# Altium schematic sheet Slave_Schematic2.SchDoc
size A4; SheetNumber: 2; SheetTotal: 2
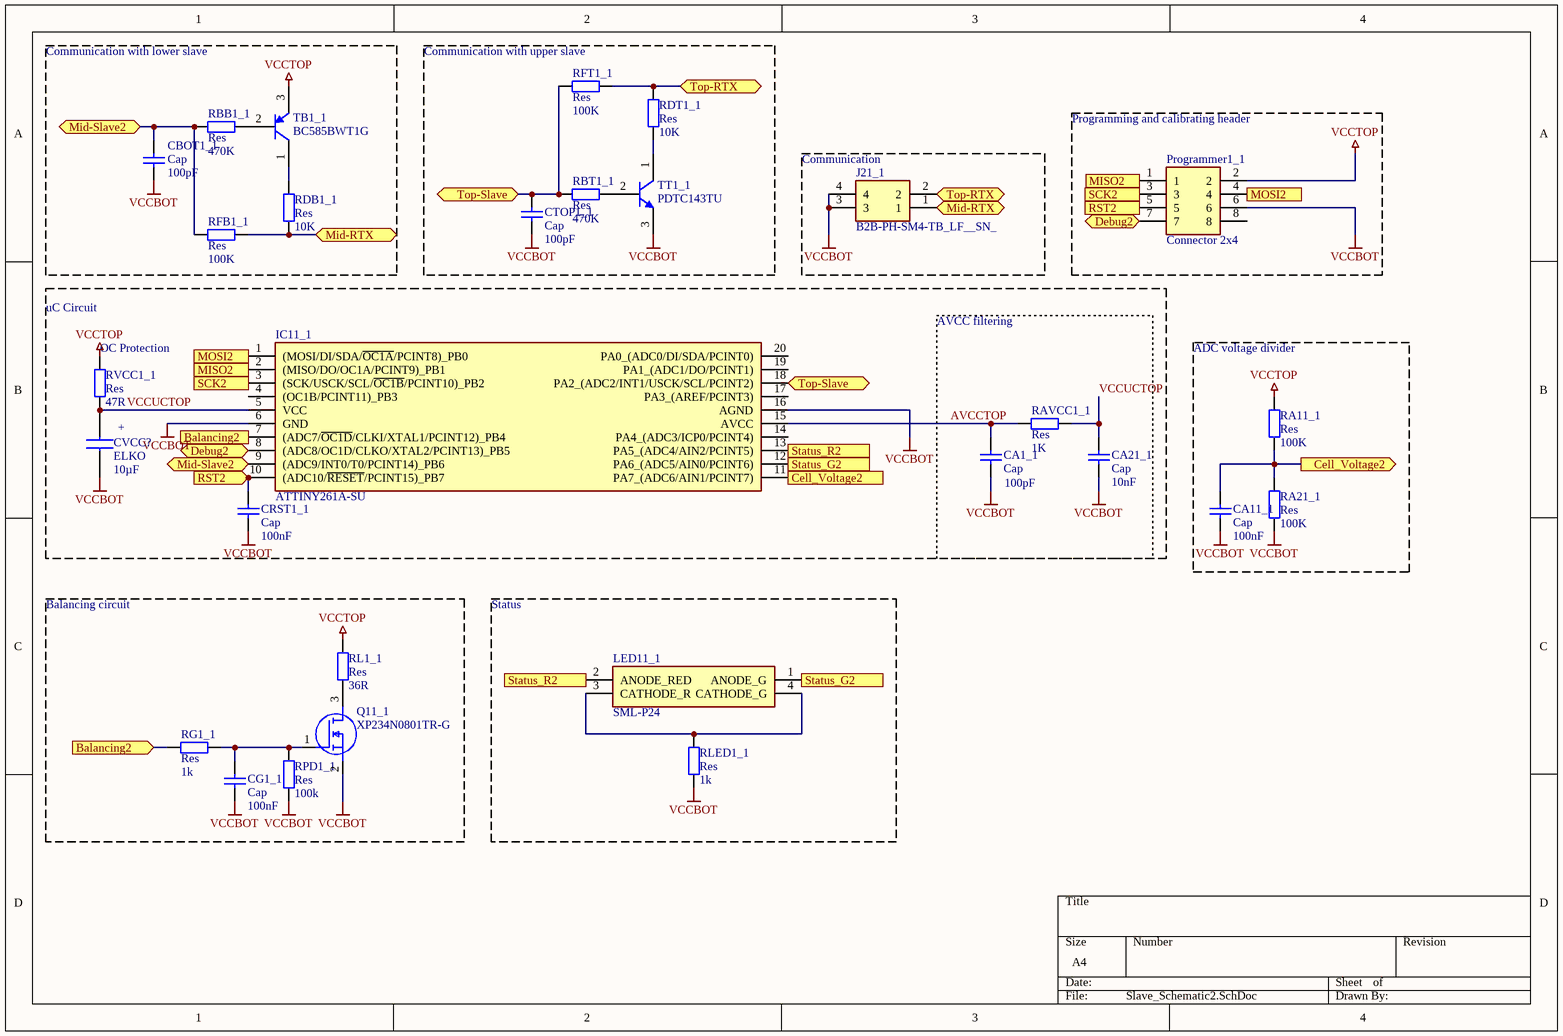
[diagram p0: Slave_Schematic2.SchDoc]

## Parts
CA1_1  Cap  value 100pF  [0603]
CA11_1  Cap  value 100nF  [0603]
CA21_1  Cap  value 10nF  [0603]
CBOT1_1  Cap  value 100pF  [0603]
CG1_1  Cap  value 100nF  [0603]
CRST1_1  Cap  value 100nF  [0603]
CTOP1_1  Cap  value 100pF  [0603]
CVCC?  ELKO  value 10µF  [CAP 5x5,5]
IC11_1  ATTINY261A-SU  [TSSOP-20T (MO-153 AC)]
J21_1  B2B-PH-SM4-TB_LF__SN_  [JST-PHR]
LED11_1  SML-P24  [1010 LED]
Programmer1_1  Connector 2x4  [Pads 2X4]
Q11_1  XP234N0801TR-G  [SOT-23 (TO-236)]
RA11_1  Res  value 100K  [0603]
RA21_1  Res  value 100K  [0603]
RAVCC1_1  Res  value 1K  [0603]
RBB1_1  Res  value 470K  [0603]
RBT1_1  Res  value 470K  [0603]
RDB1_1  Res  value 10K  [0603]
RDT1_1  Res  value 10K  [0603]
RFB1_1  Res  value 100K  [0603]
RFT1_1  Res  value 100K  [0603]
RG1_1  Res  value 1k  [0603]
RL1_1  Res  value 36R  [1020 (Reversed)]
RLED1_1  Res  value 1k  [0603]
RPD1_1  Res  value 100k  [0603]
RVCC1_1  Res  value 47R  [0603]
TB1_1  BC585BWT1G  [SOT-323 (SC-70)]
TT1_1  PDTC143TU  [SOT-323 (SC-70)]

## Blocks framed on the sheet
Communication with lower slave: CBOT1_1 RBB1_1 RDB1_1 RFB1_1 TB1_1
Communication with upper slave: CTOP1_1 RBT1_1 RDT1_1 RFT1_1 TT1_1
Programming and calibrating header: Programmer1_1
Communication: J21_1
AVCC filtering: CA1_1 CA21_1 RAVCC1_1
ADC voltage divider: CA11_1 RA11_1 RA21_1
Balancing circuit: CG1_1 Q11_1 RG1_1 RL1_1 RPD1_1
Status: LED11_1 RLED1_1

## Ports
Balancing2 (in), Balancing2 (out), Cell_Voltage2 (in), Cell_Voltage2 (out), Debug2 (bidir), Mid-RTX (bidir), Mid-Slave2 (bidir), MISO2 (in), MISO2 (out), MOSI2 (in), MOSI2 (out), RST2 (in), RST2 (out), SCK2 (in), SCK2 (out), Status_G2 (in), Status_G2 (out), Status_R2 (in), Status_R2 (out), Top-RTX (bidir), Top-Slave (bidir)

## Nets
VCCBOT: CA1_1.1 CA11_1.1 CA21_1.1 CBOT1_1.1 CG1_1.1 CRST1_1.1 CTOP1_1.1 CVCC?.2(-) IC11_1.6(GND) IC11_1.16(AGND) J21_1.3 J21_1.4 Programmer1_1.6 Q11_1.2(S) RA21_1.1 RLED1_1.1 RPD1_1.1 TT1_1.3(E)
VCCTOP: Programmer1_1.2 RA11_1.2 RL1_1.2 RVCC1_1.2 TB1_1.3(E)
AVCCTOP: CA1_1.2 IC11_1.15(AVCC) RAVCC1_1.1
Balancing2: IC11_1.7((ADC7/~{OC1D}/CLKI/XTAL1/PCINT12)_PB4) RG1_1.1 ; port Balancing2
Cell_Voltage2: CA11_1.2 IC11_1.11(PA7_(ADC6/AIN1/PCINT7)) RA11_1.1 RA21_1.2 ; port Cell_Voltage2
Debug2: IC11_1.8((ADC8/OC1D/CLKO/XTAL2/PCINT13)_PB5) Programmer1_1.7 ; port Debug2
Mid-RTX: J21_1.1 RDB1_1.1 RFB1_1.2 ; port Mid-RTX
Mid-Slave2: CBOT1_1.2 IC11_1.9((ADC9/INT0/T0/PCINT14)_PB6) RBB1_1.1 RFB1_1.1 ; port Mid-Slave2
MISO2: IC11_1.2((MISO/DO/OC1A/PCINT9)_PB1) Programmer1_1.1 ; port MISO2
MOSI2: IC11_1.1((MOSI/DI/SDA/~{OC1A}/PCINT8)_PB0) Programmer1_1.4 ; port MOSI2
RST2: CRST1_1.2 IC11_1.10((ADC10/~{RESET}/PCINT15)_PB7) Programmer1_1.5 ; port RST2
SCK2: IC11_1.3((SCK/USCK/SCL/~{OC1B}/PCINT10)_PB2) Programmer1_1.3 ; port SCK2
Status_G2: IC11_1.12(PA6_(ADC5/AIN0/PCINT6)) LED11_1.1(ANODE_G) ; port Status_G2
Status_R2: IC11_1.13(PA5_(ADC4/AIN2/PCINT5)) LED11_1.2(ANODE_RED) ; port Status_R2
Top-RTX: J21_1.2 RDT1_1.2 RFT1_1.2 ; port Top-RTX
Top-Slave: CTOP1_1.2 IC11_1.18(PA2_(ADC2/INT1/USCK/SCL/PCINT2)) RBT1_1.1 RFT1_1.1 ; port Top-Slave
VCCUCTOP: CA21_1.2 CVCC?.1(+) IC11_1.5(VCC) RAVCC1_1.2 RVCC1_1.1
NetCG1_1_2: CG1_1.2 Q11_1.1(G) RG1_1.2 RPD1_1.2
NetLED11_1_3: LED11_1.3(CATHODE_R) LED11_1.4(CATHODE_G) RLED1_1.2
NetQ11_1_3: Q11_1.3(D) RL1_1.1
NetRBB1_1_2: RBB1_1.2 TB1_1.2(B)
NetRBT1_1_2: RBT1_1.2 TT1_1.2(B)
NetRDB1_1_2: RDB1_1.2 TB1_1.1(C)
NetRDT1_1_1: RDT1_1.1 TT1_1.1(C)

Not connected (* = marked no-connect by the designer): IC11_1 4((OC1B/PCINT11)_PB3) 14(PA4_(ADC3/ICP0/PCINT4)) 17(PA3_(AREF/PCINT3)) 19(PA1_(ADC1/DO/PCINT1)) 20(PA0_(ADC0/DI/SDA/PCINT0)); Programmer1_1 8

## Notes on the sheet
- uC Circuit
- (near RVCC1_1) OC Protection

## Library data of the parts
CA1_1 CA11_1 CA21_1 CBOT1_1 CG1_1 CRST1_1 CTOP1_1 = Cap: Capacitor; Published: 8-Jun-2000; LatestRevisionDate: 17-Jul-2002; LatestRevisionNote: Re-released for DXP Platform.; PackageReference: RAD-0.3; Publisher: Altium Limited; PackageDescription: Radial Cap, Thru-Hole; 2 Leads; 0.3 in Pin Spacing
CVCC? = ELKO: Capacitor; Manufacturer_Name: NIC Components; Manufacturer_Part_Number: NACE470M6.3V5X5.5TR13F; Datasheet Link: https://docs.rs-online.com/e28d/0900766b80f8cf40.pdf; Height: 5.5mm
IC11_1 = ATTINY261A-SU: Integrated Circuit; Manufacturer_Name: Microchip; Datasheet Link: http://www.atmel.com/Images/doc8197.pdf; Height: 2.65mm; Manufacturer_Part_Number: ATTINY261A-SU; Mouser Part Number: 556-ATTINY261A-SU; Mouser Price/Stock: https://www.mouser.co.uk/ProductDetail/Microchip-Technology-Atmel/ATTINY261A-SU?qs=LHmEVA8xxfYkt4Dy%2F2AOtw%3D%3D; Arrow Part Number: ATTINY261A-SU; Arrow Price/Stock: https://www.arrow.com/en/products/attiny261a-su/microchip-technology
J21_1 = B2B-PH-SM4-TB_LF__SN_: Connector; Manufacturer_Name: JST (JAPAN SOLDERLESS TERMINALS); Manufacturer_Part_Number: B2B-PH-SM4-TB(LF)(SN); Datasheet Link: http://www.jst-mfg.com/product/pdf/eng/ePH.pdf; Height: 6.6mm
LED11_1 = SML-P24: Dual Color LED; Manufacturer_Name: ROHM Semiconductor; Manufacturer_Part_Number: SML-P24MUWT86R; Datasheet Link: https://www.rohm.com/datasheet/SML-P24MUW(R)/sml-p24muw-e; Height: 0.25mm; Mouser Part Number: 755-SML-P24MUWT86R; Mouser Price/Stock: https://www.mouser.co.uk/ProductDetail/ROHM-Semiconductor/SML-P24MUWT86R?qs=SP2aZMzhwxgr8eZ6SbTI9w%3D%3D
Programmer1_1 = Connector 2x4: Connector 1,27mm; Manufacturer_Name: Mill-Max; Manufacturer_Part_Number: 855-22-008-10-001101; Datasheet Link: https://componentsearchengine.com/Datasheets/2/855-22-008-10-001101.pdf; Height: 6.27mm; Mouser Part Number: 575-855-22-008-10; Mouser Price/Stock: https://www.mouser.co.uk/ProductDetail/Mill-Max/855-22-008-10-001101?qs=mPCt1EmoOdQMosTdRU7w4Q%3D%3D
Q11_1 = XP234N0801TR-G: MOSFET (N-Channel); Manufacturer_Name: Torex; Datasheet Link: https://4donline.ihs.com/images/VipMasterIC/IC/TOSL/TOSL-S-A0008892481/TOSL-S-A0008892481-1.pdf?hkey=CECEF36DEECDED6468708AAF2E19C0C6; Height: 1.15mm; Manufacturer_Part_Number: XP234N0801TR-G; Mouser Part Number: 865-XP234N0801TR-G; Mouser Price/Stock: https://www.mouser.co.uk/ProductDetail/Torex-Semiconductor/XP234N0801TR-G?qs=BJlw7L4Cy7%252BWe%2FbHvnXcKQ%3D%3D
RA11_1 RA21_1 RAVCC1_1 RBB1_1 RBT1_1 RDB1_1 RDT1_1 RFB1_1 RFT1_1 RG1_1 RL1_1 RLED1_1 RPD1_1 RVCC1_1 = Res: Resistor; Published: 8-Jun-2000; LatestRevisionDate: 17-Jul-2002; LatestRevisionNote: Re-released for DXP Platform.; PackageReference: AXIAL-0.4; Publisher: Altium Limited; PackageDescription: Axial Device, Thru-Hole; 2 Leads; 0.4 in Pin Spacing
TB1_1 = BC585BWT1G: PNP; pin to pad: 1>3 2>1 3>2; Published: 8-Jun-2000; LatestRevisionDate: 29-May-2009; LatestRevisionNote: IPC-7351 Footprint Added.; PackageVersion: Aug-1999; PackageReference: SOT-23B; Publisher: Altium Limited; PackageDescription: 3-Pin SOT-23 Package 0.95 mm Pitch, 2.4 mm Lead Span
TT1_1 = PDTC143TU: NPN; pin to pad: 1>3 2>1 3>2; Published: 8-Jun-2000; LatestRevisionDate: 17-Jul-2002; LatestRevisionNote: Re-released for DXP Platform.; PackageReference: TO-226-AA; Publisher: Altium Limited; PackageDescription: TO, Flat Index; 3 In-Line, Axial Leads; Body Dia. 4.8mm; Leads 0.55 x 0.51 mm (max); Code_JEDEC: TO-226-AA